# EAGLE design LOCO-Control (EAGLE 9.5.2)
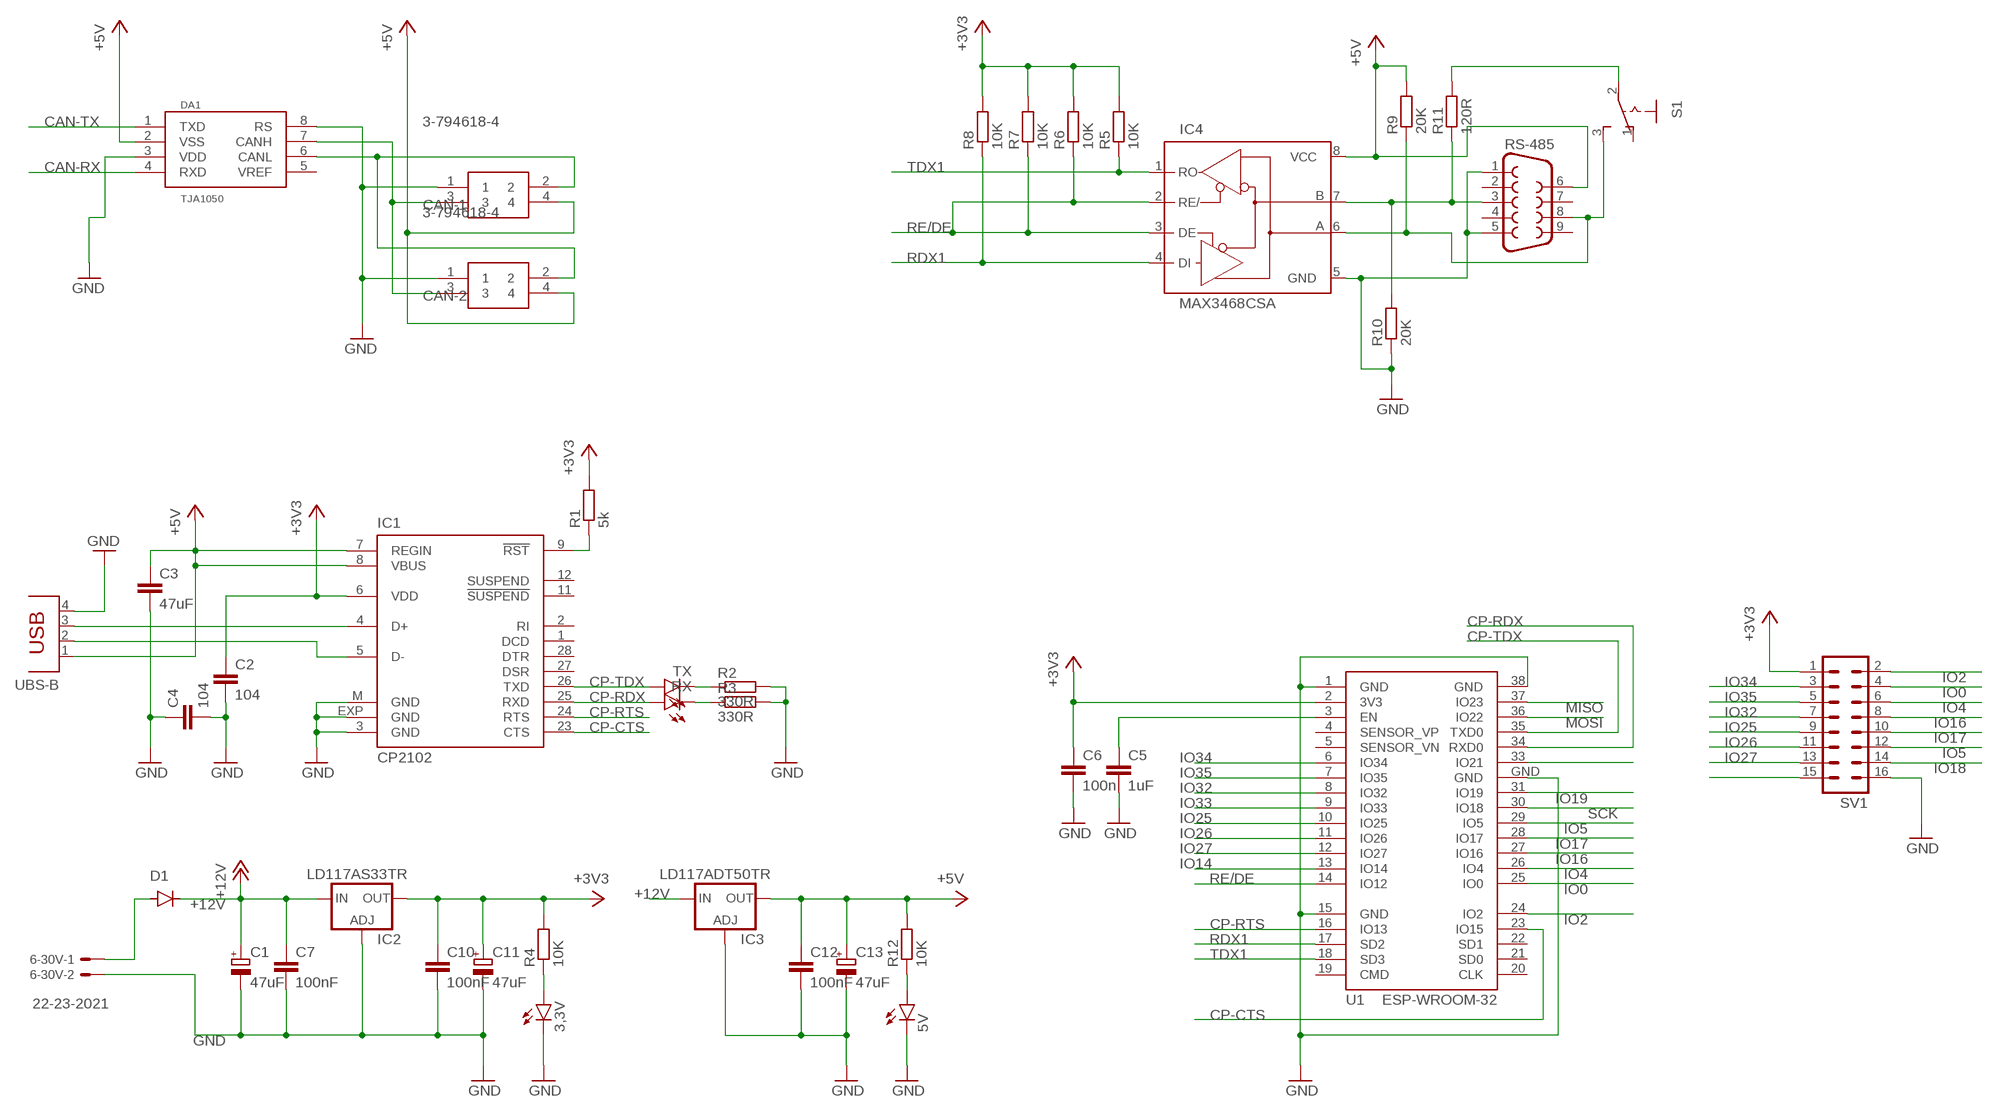
[diagram p0: schematic, sheet 1]

## Parts
3,3V  LED  [SMARTLED-TTW]
5V  LED  [SMARTLED-TTW]
6-30V  22-23-2021  [22-23-2021]
C1  47uF  CPOL-EUB/3528-21R  [B/3528-21R]
C2  104  C-EUC0402  [C0402]
C3  47uF  C-EUC0402  [C0402]
C4  104  C-EUC0402  [C0402]
C5  1uF  C-EUC0402  [C0402]
C6  100n  C-EUC0402  [C0402]
C7  100nF  C-EUC0402  [C0402]
C10  100nF  C-EUC0402  [C0402]
C11  47uF  CPOL-EUB/3528-21R  [B/3528-21R]
C12  100nF  C-EUC0402  [C0402]
C13  47uF  CPOL-EUB/3528-21R  [B/3528-21R]
CAN-1  3-794618-4  [SHDRRA4W102P300_2X2_686X892X73]
CAN-2  3-794618-4  [SHDRRA4W102P300_2X2_686X892X73]
D1  DIODE-DO-214AC  [DO-214AC]
DA1  TJA1050  [SO08]
IC1  CP2102  [MLP28]
IC2  LD117AS33TR  [SOT223]
IC3  LD117ADT50TR  [DPACK]
IC4  MAX3468CSA  [SO08]
R1  5k  R-EU_MELF0102R  [MINI_MELF-0102R]
R2  330R  R-EU_MELF0102R  [MINI_MELF-0102R]
R3  330R  R-EU_MELF0102R  [MINI_MELF-0102R]
R4  10K  R-EU_MELF0102R  [MINI_MELF-0102R]
R5  10K  R-EU_MELF0102R  [MINI_MELF-0102R]
R6  10K  R-EU_MELF0102R  [MINI_MELF-0102R]
R7  10K  R-EU_MELF0102R  [MINI_MELF-0102R]
R8  10K  R-EU_MELF0102R  [MINI_MELF-0102R]
R9  20K  R-EU_MELF0102R  [MINI_MELF-0102R]
R10  20K  R-EU_MELF0102R  [MINI_MELF-0102R]
R11  120R  R-EU_MELF0102R  [MINI_MELF-0102R]
R12  10K  R-EU_MELF0102R  [MINI_MELF-0102R]
RS-485  F09H  [F09H]
RX  LED  [SMARTLED-TTW]
S1  255SB  [255SB]
SV1  MA08-2  [MA08-2]
TX  LED  [SMARTLED-TTW]
U1  ESP-WROOM-32  [ESP-WROOM-32]
UBS-B  PN61729  [PN61729]

## Nets
+3V3: C2.1 C6.1 C10.1 C11.+ IC1.6(VDD) IC2.4(OUT) R1.2 R4.2 R5.2 R6.2 R7.2 R8.2 SV1.1 U1.2(3V3)
+5V: C3.1 C12.1 C13.+ CAN-1.4 CAN-2.4 DA1.2(VSS) IC1.7(REGIN) IC1.8(VBUS) IC3.4(OUT) IC4.8(VCC) R9.2 R12.2 RS-485.6 UBS-B.1
+12V: C1.+ C7.1 D1.C IC2.3(IN) IC3.3(IN)
CAN-RX: DA1.4(RXD)
CAN-TX: DA1.1(TXD)
CP-CTS: IC1.23(CTS) U1.23(IO15)
CP-RDX: IC1.25(RXD) RX.A@1(A) U1.34(RXD0)
CP-RTS: IC1.24(RTS) U1.16(IO13)
CP-TDX: IC1.26(TXD) TX.A@1(A) U1.35(TXD0)
GND: 3,3V.C@1(C) 5V.C@1(C) 6-30V.2 C1.- C2.2 C3.2 C4.1 C4.2 C5.2 C6.2 C7.2 C10.2 C11.- C12.2 C13.- CAN-1.1 CAN-2.1 DA1.3(VDD) DA1.8(RS) IC1.3(GND) IC1.EXP(GND) IC1.M(GND) IC2.1(ADJ) IC3.1(ADJ) IC4.5(GND) R2.2 R3.2 R10.1 RS-485.1 RS-485.5 SV1.16 U1.1(GND) U1.15(GND) U1.38(GND) U1.GND UBS-B.4
IO0: SV1.4 U1.25(IO0)
IO2: SV1.2 U1.24(IO2)
IO4: SV1.6 U1.26(IO4)
IO5: SV1.12 U1.29(IO5)
IO14: SV1.15 U1.13(IO14)
IO16: SV1.8 U1.27(IO16)
IO17: SV1.10 U1.28(IO17)
IO18: SV1.14
IO19: U1.31(IO19)
IO25: SV1.9 U1.10(IO25)
IO26: SV1.11 U1.11(IO26)
IO27: SV1.13 U1.12(IO27)
IO32: SV1.7 U1.8(IO32)
IO33: U1.9(IO33)
IO34: SV1.3 U1.6(IO34)
IO35: SV1.5 U1.7(IO35)
MISO: U1.37(IO23)
MOSI: U1.36(IO22)
N$1: IC1.5(D-) UBS-B.2
N$2: IC1.4(D+) UBS-B.3
N$3: IC1.9(!RST) R1.1
N$4: 6-30V.1 D1.A
N$5: R2.1 TX.C@1(C)
N$6: 3,3V.A@1(A) R4.1
N$7: R3.1 RX.C@1(C)
N$8: CAN-1.3 CAN-2.3 DA1.7(CANH)
N$9: CAN-1.2 CAN-2.2 DA1.6(CANL)
N$10: IC4.6(A) R9.1 RS-485.8 S1.3(S)
N$11: IC4.7(B) R10.2 R11.1 RS-485.3
N$12: R11.2 S1.2(P)
N$13: 5V.A@1(A) R12.1
N$30: U1.33(IO21)
RDX1: IC4.4(DI) R8.1 U1.17(SD2)
RE/DE: IC4.2(RE/) IC4.3(DE) R6.1 R7.1 U1.14(IO12)
RESET: C5.1 U1.3(EN)
SCK: U1.30(IO18)
TDX1: IC4.1(RO) R5.1 U1.18(SD3)
Unconnected: DA1.5(VREF) IC1.1(DCD) IC1.2(RI) IC1.11(!SUSPEND) IC1.12(SUSPEND) IC1.27(DSR) IC1.28(DTR) RS-485.2 RS-485.4 RS-485.7 RS-485.9 S1.1(O) U1.4(SENSOR_VP) U1.5(SENSOR_VN) U1.19(CMD) U1.20(CLK) U1.21(SD0) U1.22(SD1)

## Library data of the parts
3,3V 5V RX TX = led:LED: LED OSRAM: - CHIPLED LG R971, LG N971, LY N971, LG Q971, LY Q971, LO R971, LY R971 LH N974, LH R974 LS Q976, LO Q976, LY Q976 LO Q996 - Hyper CHIPLED LW Q18S LB Q993, LB Q99A, LB R99A - SideLED LS A670, LO A670, LY A670, LG A670, LP A670 LB A673, LV A673, LT A673, LW A673 LH A674 LY A675 LS A676, LA A676, LO A676, LY A676, LW A676 LS A679, LY A679, LG A679 - Hyper Micro SIDELED® LS Y876, LA Y876, LO Y876, LY Y876 LT Y87S - SmartLED LW L88C, LW L88S LB L89C, LB L89S, LG L890 LS L89K, LO L89K, LY L89K LS L896, LA L896, LO L896, LY L896 - TOPLED LS T670, LO T670, LY T670, LG T670, LP T670 LSG T670, LSP T670, LSY T670, LOP T670, LYG T670 LG T671, LOG T671, LSG T671 LB T673, LV T673, LT T673, LW T673 LH T674 LS T676, LA T676, LO T676, LY T676, LB T676, LH T676, LSB T676, LW T676 LB T67C, LV T67C, LT T67C, LS T67K, LO T67K, LY T67K, LW E67C LS E67B, LA E67B, LO E67B, LY E67B, LB E67C, LV E67C, LT E67C LW T67C LS T679, LY T679, LG T679 LS T770, LO T770, LY T770, LG T770, LP T770 LB T773, LV T773, LT T773, LW T773 LH T774 LS E675, LA E675, LY E675, LS T675 LS T776, LA T776, LO T776, LY T776, LB T776 LHGB T686 LT T68C, LB T68C - Hyper Mini TOPLED® LB M676 - Mini TOPLED Santana® LG M470 LS M47K, LO M47K, LY M47K Source: http://www.osram.convergy.de LUXEON: - LUMILED® LXK2-PW12-R00, LXK2-PW12-S00, LXK2-PW14-U00, LXK2-PW14-V00 LXK2-PM12-R00, LXK2-PM12-S00, LXK2-PM14-U00 LXK2-PE12-Q00, LXK2-PE12-R00, LXK2-PE12-S00, LXK2-PE14-T00, LXK2-PE14-U00 LXK2-PB12-K00, LXK2-PB12-L00, LXK2-PB12-M00, LXK2-PB14-N00, LXK2-PB14-P00, LXK2-PB14-Q00 LXK2-PR12-L00, LXK2-PR12-M00, LXK2-PR14-Q00, LXK2-PR14-R00 LXK2-PD12-Q00, LXK2-PD12-R00, LXK2-PD12-S00 LXK2-PH12-R00, LXK2-PH12-S00 LXK2-PL12-P00, LXK2-PL12-Q00, LXK2-PL12-R00 Source: www.luxeon.com KINGBRIGHT: KA-3528ASYC Source: www.kingbright.com
6-30V = con-molex:22-23-2021: .100" (2.54mm) Center Header - 2 Pin; MF: MOLEX; MPN: 22-23-2021; OC_FARNELL: 1462926; OC_NEWARK: 25C3832
C1 C11 C13 = rcl:CPOL-EU: POLARIZED CAPACITOR, European symbol; SPICEPREFIX: C
C2-C7 C10 C12 = rcl:C-EU: CAPACITOR, European symbol; SPICEPREFIX: C
CAN-1 CAN-2 = SamacSys_Parts:3-794618-4: 4 way 2 row r/a header Mate-N-Lok Source: Datasheet <https://rs.componentsearchengine.com/Datasheets/2/3-794618-4.pdf>; DESCRIPTION: 4 way 2 row r/a header Mate-N-Lok; HEIGHT: 7.37mm; MANUFACTURER_NAME: TE Connectivity; MANUFACTURER_PART_NUMBER: 3-794618-4
D1 = diode:DIODE-: DIODE
DA1 = TJA1050:TJA1050: High speed CAN transceiver Input levels compatible with 3.3 V and 5 V devices 5V supply
IC1 = silabs:CP210*: Single-Chip USB to UART Bridge Source: www.silabs.com .. CP2101.pdf / cp2102.pdf; MF: FARNELL; MPN: CP2102-GM; OC_FARNELL: 9282130; OC_NEWARK: 30K5635
IC2 IC3 = v-reg:LD117A?*: Low drop fixed and adjustable positive voltage regulators 1 A Source: http://www.st.com/stonline/products/literature/ds/7194/ld1117axx.pdf
IC4 = maxim:MAX34*: +5V, Fail-Safe, 40Mbps, Profibus RS-485/RS-422 Transceivers Source: MAX3465-MAX3469.pdf; MPN: MAX3468CSA+; OC_FARNELL: unknown; OC_NEWARK: 76K6721
R1-R12 = rcl:R-EU_: RESISTOR, European symbol; SPICEPREFIX: R
RS-485 = con-subd:F09: SUB-D; OC_FARNELL: unknown; OC_NEWARK: unknown
S1 = switch:255SB: SLIDING SWITCH Distributor Buerklin, 11G810
SV1 = con-lstb:MA08-2: PIN HEADER; OC_FARNELL: unknown; OC_NEWARK: unknown
U1 = esp32:ESP-WROOM-32: Espressif Systems ESP-WROOM-32
UBS-B = con-berg:PN61729: BERG USB connector; OC_FARNELL: unknown; OC_NEWARK: unknown

## Board
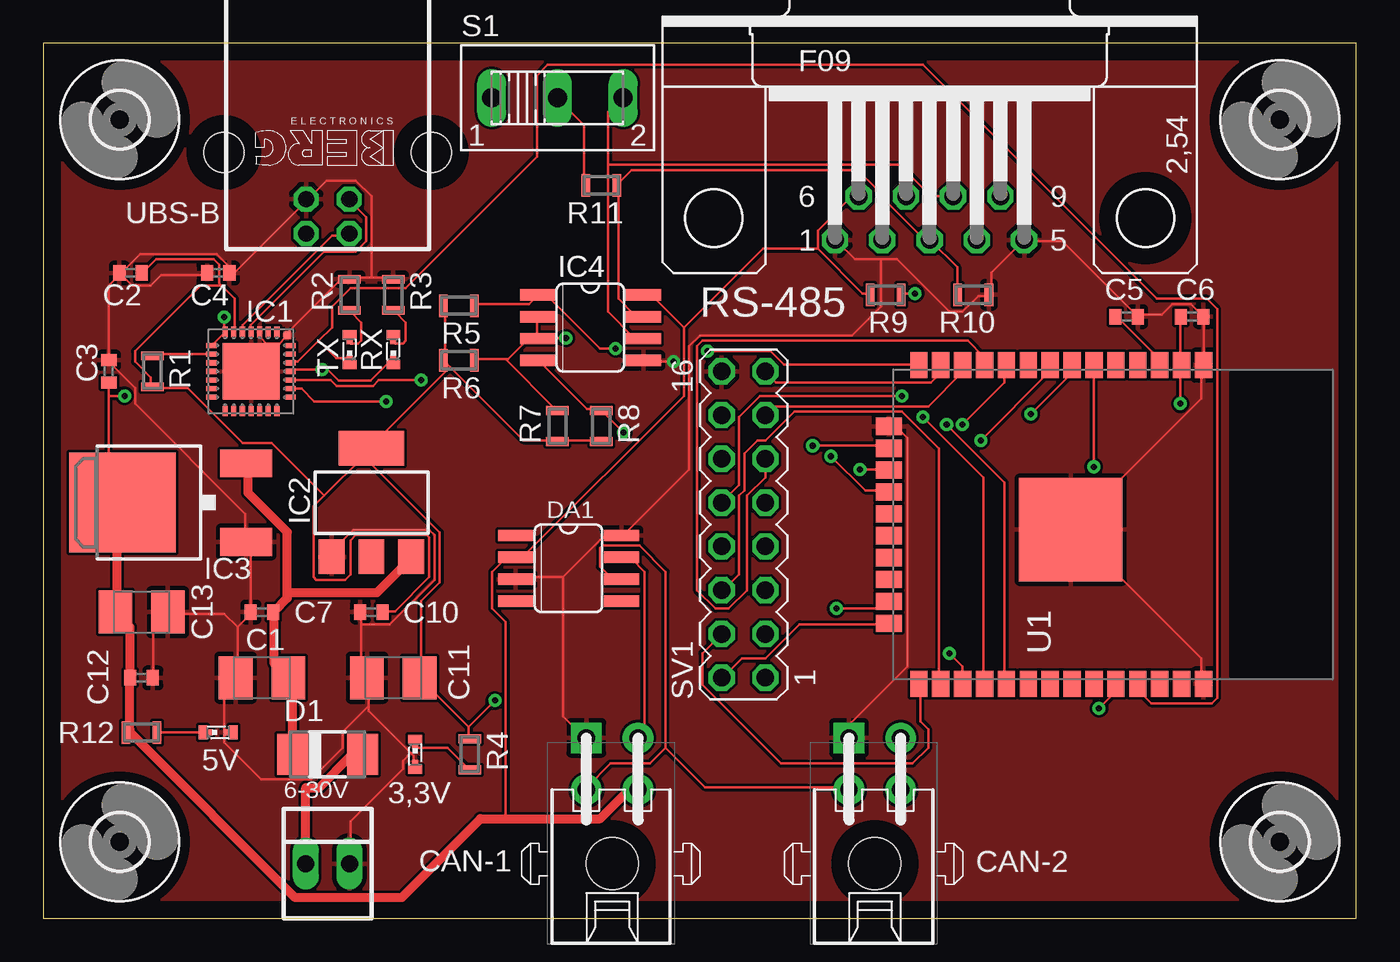
[diagram p1: board, top side]
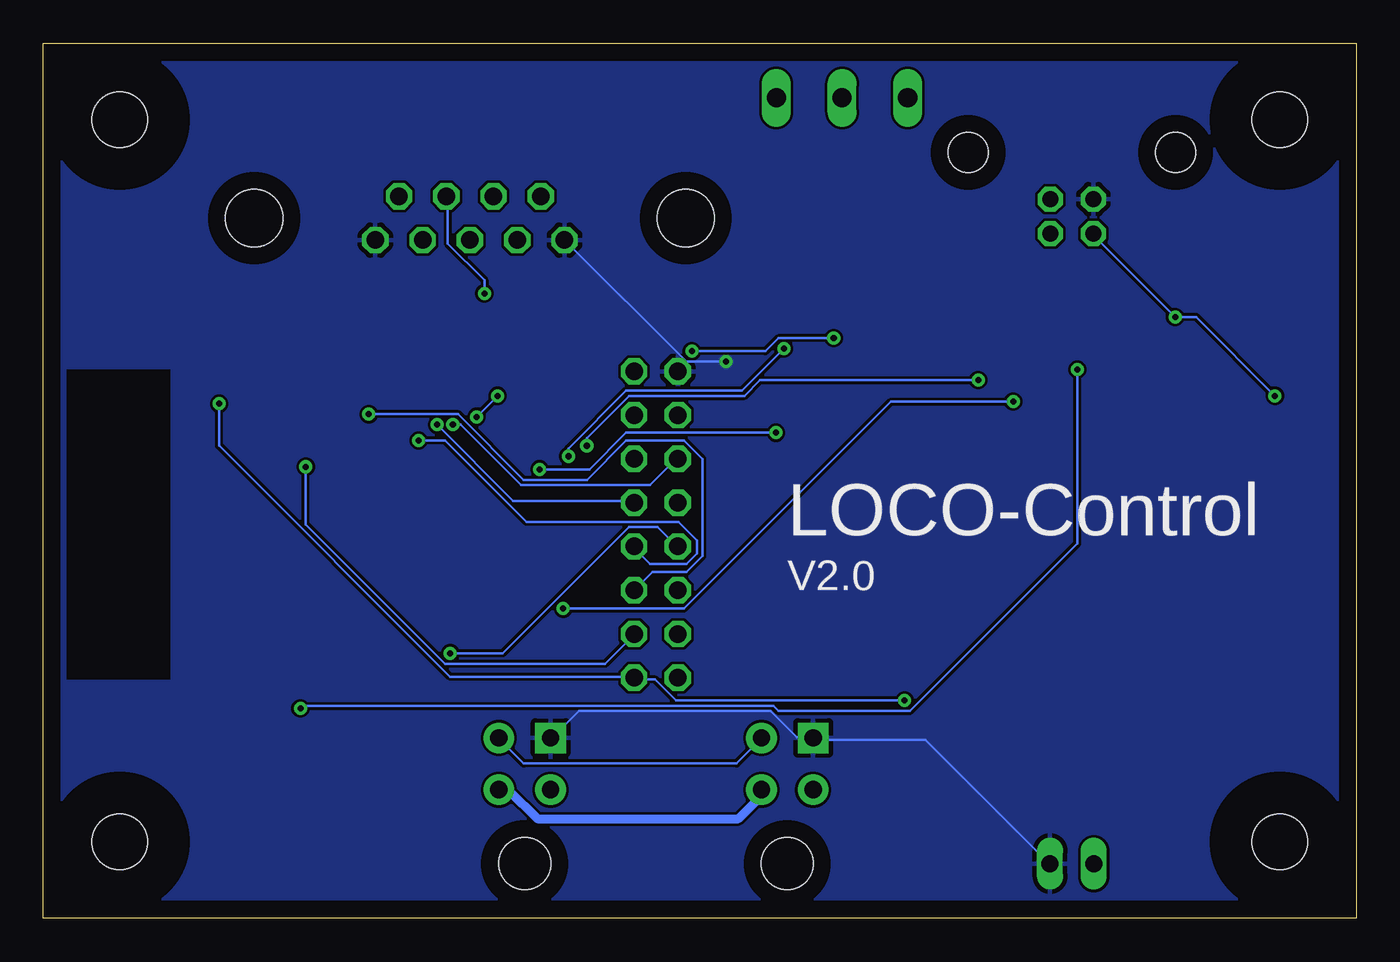
[diagram p2: board, bottom side, seen from below]

Size 76.2 x 50.8 mm. Coordinates in mm from the lower left corner, seen from the top.
Outline: 0,0 76.2,0 76.2,50.8 0,50.8 0,0
Copper layers (1*16): Top 0.035mm / dielectric 1.5mm / Bottom 0.035mm
Design rules "default": minimum track width 6mil, minimum drill 0.35mm, track to track 6mil, track to pad 6mil, pad to pad 6mil, via to via 6mil, smd to smd 6mil, copper to edge 40mil, drill to drill 6mil, minimum pad ring 10mil, minimum via ring 8mil, stop-mask expansion 4mil, vias tented up to drill 0mil, thermal gap 10mil

### Footprints (pad centres in the part's own frame; a part is rotated, then mirrored left to right if it is on the bottom)
SMARTLED-TTW = smd 0.8 x 0.5: A 0,-0.875; C 0,0.875 | smd 0.35 x 0.35: A@1 0,-0.5; C@1 0,0.5
22-23-2021 = drill 1 long: 1 -1.27,0; 2 1.27,0
B/3528-21R = smd 1.95 x 2.5: + 1.525,0; - -1.525,0
C0402 = smd 0.7 x 0.9: 1 -0.65,0; 2 0.65,0
SHDRRA4W102P300_2X2_686X892X73 = drill 1 pad 1.778 square: 1 1.5,-7.3 | drill 1 pad 1.778: 2 1.5,-4.3; 3 -1.5,-7.3; 4 -1.5,-4.3 | hole 3: 0,0
DO-214AC = smd 1.8 x 2.4: A 2.025,0; C -2.025,0
SO08 = smd 0.66 x 2.032: 1 -1.905,-3.073; 2 -0.635,-3.073; 3 0.635,-3.073; 4 1.905,-3.073; 5 1.905,3.073; 6 0.635,3.073; 7 -0.635,3.073; 8 -1.905,3.073
MLP28 = smd 0.6 x 0.3: 1 -2.3,1.5; 2 -2.3,1; 3 -2.3,0.5; 4 -2.3,0; 5 -2.3,-0.5; 6 -2.3,-1; 7 -2.3,-1.5; 15 2.3,-1.5; 16 2.3,-1; 17 2.3,-0.5; 18 2.3,0; 19 2.3,0.5; 20 2.3,1; 21 2.3,1.5 | smd 0.3 x 0.6: 8 -1.5,-2.3; 9 -1,-2.3; 10 -0.5,-2.3; 11 0,-2.3; 12 0.5,-2.3; 13 1,-2.3; 14 1.5,-2.3; 22 1.5,2.3; 23 1,2.3; 24 0.5,2.3; 25 0,2.3; 26 -0.5,2.3; 27 -1,2.3; 28 -1.5,2.3 | smd 3.3 x 3.3: EXP 0,0 | smd 0.435 x 0.435: M -2.103,2.103
SOT223 = smd 1.5 x 2: 1 -2.3,-3.15; 2 0,-3.15; 3 2.3,-3.15 | smd 3.8 x 2: 4 0,3.15
DPACK = smd 1.6 x 3: 1 -2.28,-4.8; 3 2.28,-4.8 | smd 5.8 x 6.2: 4 0,2.38
MINI_MELF-0102R = smd 0.5 x 1.3: 1 -0.9,0; 2 0.9,0
F09H = drill 1.016 octagon: 1 -5.486,-1.27; 2 -2.743,-1.27; 3 0,-1.27; 4 2.743,-1.27; 5 5.486,-1.27; 6 -4.115,1.27; 7 -1.372,1.27; 8 1.372,1.27; 9 4.115,1.27 | hole 3.302: -12.522,0; 12.522,0
255SB = drill 1.118 long: 1 -3.81,0; 2 0,0; 3 3.81,0
MA08-2 = drill 1.016 octagon: 1 -8.89,-1.27; 2 -8.89,1.27; 3 -6.35,-1.27; 4 -6.35,1.27; 5 -3.81,-1.27; 6 -3.81,1.27; 7 -1.27,-1.27; 8 -1.27,1.27; 9 1.27,-1.27; 10 1.27,1.27; 11 3.81,-1.27; 12 3.81,1.27; 13 6.35,-1.27; 14 6.35,1.27; 15 8.89,-1.27; 16 8.89,1.27
ESP-WROOM-32 = smd 1.5 x 1: 1 -9.25,7; 2 -9.25,5.73; 3 -9.25,4.46; 4 -9.25,3.19; 5 -9.25,1.92; 6 -9.25,0.65; 7 -9.25,-0.62; 8 -9.25,-1.89; 9 -9.25,-3.16; 10 -9.25,-4.43; 11 -9.25,-5.7; 12 -9.25,-6.97; 13 -9.25,-8.24; 14 -9.25,-9.51; 25 9.25,-9.51; 26 9.25,-8.24; 27 9.25,-6.97; 28 9.25,-5.7; 29 9.25,-4.43; 30 9.25,-3.16; 31 9.25,-1.89; 32 9.25,-0.62; 33 9.25,0.65; 34 9.25,1.92; 35 9.25,3.19; 36 9.25,4.46; 37 9.25,5.73; 38 9.25,7 | smd 1 x 1.5: 15 -5.7,-11.25; 16 -4.43,-11.25; 17 -3.16,-11.25; 18 -1.89,-11.25; 19 -0.62,-11.25; 20 0.65,-11.25; 21 1.92,-11.25; 22 3.19,-11.25; 23 4.46,-11.25; 24 5.73,-11.25 | smd 6 x 6: GND 0.3,-0.7
3,2 = hole 3.2: 0,0
PN61729 = drill 0.95 octagon: 1 1.25,4.71; 2 -1.25,4.71; 3 -1.25,2.71; 4 1.25,2.71 | hole 2.3: -6.02,0; 6.02,0

### Placement (x,y rotation side)
3,3V  21.59,9.53 180 top
5V  10.16,10.79 270 top
6-30V  16.51,3.17 0 top
C1  12.7,13.97 0 top
C2  5.08,37.47 180 top
C3  3.81,31.75 90 top
C4  10.16,37.47 180 top
C5  62.87,34.92 0 top
C6  66.67,34.92 0 top
C7  12.7,17.78 180 top
C10  19.05,17.78 180 top
C11  20.32,13.97 0 top
C12  5.71,13.97 0 top
C13  5.71,17.78 180 top
CAN-1  33.02,3.17 180 top
CAN-2  48.26,3.17 180 top
D1  16.51,9.53 0 top
DA1  30.48,20.32 270 top
IC1  12.06,31.75 270 top
IC2  19.05,24.13 0 top
IC3  6.99,24.13 90 top
IC4  31.75,34.29 270 top
R1  6.35,31.75 270 top
R2  17.78,36.2 90 top
R3  20.32,36.2 90 top
R4  24.77,9.53 90 top
R5  24.13,35.56 180 top
R6  24.13,32.38 180 top
R7  29.84,28.57 270 top
R8  32.38,28.57 270 top
R9  48.9,36.2 180 top
R10  53.98,36.2 180 top
R11  32.38,42.55 180 top
R12  5.71,10.79 180 top
RS-485  51.44,40.64 0 top
RX  20.32,33.02 0 top
S1  29.84,47.62 0 top
SV1  40.64,22.86 90 top
TX  17.78,33.02 0 top
U1  60.33,22.86 270 top
U$2  [3,2]  4.45,4.45 0 top
U$3  [3,2]  71.75,4.45 0 top
U$4  [3,2]  4.45,46.35 0 top
U$5  [3,2]  71.75,46.35 0 top
UBS-B  16.51,44.45 180 top

### Tracks (layer width: path | path; a pad name or v marks a point on that pad's centre or on a via)
+3V3  (via drill 0.35)
  Top 0.152: C6.1 65.99,34.9 65.99,32.16 U1.2 65.99,32 v65.99,29.87 | R8.2 32.31,27.74 29.87,27.74 R7.2 29.72,27.74 27.89,27.74 23.62,32 | R5.2 23.32,35.51 23.32,32.46 R6.2 23.32,32.31 23.62,32 | 10.36,36.73 10.21,36.88 10.21,37.95 9.91,38.25 6.55,38.25 5.79,37.49 C2.1 | 10.36,36.73 11.12,35.97 11.12,34.14 IC1.6 | 10.36,36.73 9.14,36.73 5.33,32.92 5.33,32.31 6.25,31.39 6.25,30.94 R1.2 6.4,30.79 8.38,30.79 11.58,27.58 13.26,27.58 16.31,24.54 | 24.69,11.12 24.69,10.52 R4.2 | 24.69,11.12 21.95,13.87 C11.+ 21.95,14.02 21.95,18.44 23.01,19.51 23.01,22.4 18.59,26.82 | IC2.4 18.59,26.82 | 18.59,26.82 16.31,24.54 | 16.31,24.54 15.7,23.93 15.7,19.81 15.85,19.66 17.53,19.66 17.83,19.96 17.83,21.95 18.14,22.25 22.25,22.25 22.4,22.1 22.4,19.81 20.42,17.83 19.81,17.83 C10.1 | IC2.4 | 18.59,26.82 IC2.4 | 23.62,32 19.05,27.43 IC2.4 | 24.69,11.12 v26.21,12.65
  Bottom 0.152: v65.99,29.87 65.99,27.43 52.58,14.02 41.91,14.02 SV1.1 41.91,13.87 40.69,13.87 39.47,12.65 v26.21,12.65
+5V  (via drill 0.35)
  Top 0.152: IC1.8 9.91,33.38 10.52,33.98 IC1.7 10.52,34.14 v10.52,34.9 | 5.03,13.87 C12.1 5.03,14.02 | 4.88,10.82 R12.2 4.97,10.79 5.01,10.83 5.03,10.84 | 4.27,17.68 C13.+ 4.27,17.83 | 3.81,30.33 3.81,24.99 4.57,24.23 IC3.4 4.57,24.08 4.27,23.77 | 3.81,30.33 C3.1 | 3.81,30.33 v4.72,30.33 | 44.96,38.86 47.55,36.27 47.85,36.27 R9.2 | 44.96,38.86 44.96,39.93 46.94,41.91 RS-485.6 | 37.19,34.29 37.19,30.33 27.89,21.03 27.43,21.03 DA1.2 27.28,20.88 26.82,20.88 26.06,20.12 26.06,17.98 26.82,17.22 26.82,5.79 | 37.19,34.29 35.36,36.12 34.9,36.12 IC4.8 | 44.96,38.86 41.76,38.86 37.19,34.29
  Top 0.508: 5.03,10.84 5.03,10.97 | 5.03,10.97 5.03,13.87 | 4.88,10.82 5.03,10.97 | 5.03,14.02 5.03,16.92 4.27,17.68 | 4.27,23.77 4.27,17.83 | CAN-1.4 34.01,7.47 32.31,5.79 26.82,5.79 25.38,5.79 20.81,1.21 14.63,1.21 5.01,10.83
  Bottom 0.152: UBS-B.1 15.24,39.62 v10.52,34.9 9.3,34.9 v4.72,30.33
  Bottom 0.508: CAN-1.4 34.52,7.12 35.86,5.79 47.52,5.79 49.16,7.42 CAN-2.4
+12V
  Top 0.152: 13.41,17.68 C7.1 13.41,17.83 | 14.18,14.02 14.17,14.02 | 11.89,26.36 IC3.3
  Top 0.508: 13.41,17.68 13.41,14.78 14.17,14.02 | IC2.3 21.35,20.88 19.38,18.91 14.17,18.91 | 13.41,17.83 14.17,18.59 14.17,18.91 | 11.89,26.36 11.89,24.7 14.17,22.42 14.17,18.91 | D1.C 14.48,13.97 C1.+ 14.33,13.97 14.33,13.87 14.18,13.87 14.18,14.02
CP-CTS  (via drill 0.35)
  Top 0.152: v19.91,30 15.72,30 15,30.75 IC1.23 | v46.02,17.98 48.77,17.98 49.07,18.29 U1.23
  Bottom 0.152: v19.91,30 27,30 39.01,17.98 v46.02,17.98
CP-RDX  (via drill 0.35)
  Top 0.152: v61.27,12.19 62.18,13.11 62.18,13.56 U1.34 | IC1.25 14.48,31.85 v16.19,31.85 16.51,31.85 17.14,31.22 19.02,31.22 RX.A@1
  Bottom 0.152: v16.19,31.85 16.19,21.75 25.91,12.04 33.53,12.04 33.83,12.34 61.11,12.34 v61.27,12.19
CP-RTS  (via drill 0.35)
  Top 0.152: v44.65,27.43 49.07,27.43 U1.16 | IC1.24 14.37,31.24 16.69,31.24 17.02,30.91 19.14,30.91 19.47,31.24 v21.95,31.24
  Bottom 0.152: v21.95,31.24 34.59,31.24 35.51,30.33 42.22,30.33 44.65,27.89 v44.65,27.43
CP-TDX
  Top 0.152: 16,33.53 16.76,34.29 16.76,35.51 17.83,36.58 21.03,36.58 28.65,44.2 28.65,48.92 29.26,49.53 51.05,49.53 64.62,35.97 67.51,35.97 68.12,35.36 68.12,12.8 67.82,12.5 64.31,12.5 63.55,13.26 63.55,13.56 U1.35 | 16,33.53 14.78,32.31 14.48,32.31 IC1.26 | TX.A@1 17.01,32.52 16,33.53
GND  (via drill 0.35)
  Top 0.152: U1.38 67.21,13.72 67.21,15.09 59.74,22.55 U1.GND 59.74,22.71 67.21,30.18 67.21,32 U1.1 67.36,32.16 67.36,34.9 C6.2 67.21,35.05 66.6,35.66 65.53,35.66 64.92,35.05 63.55,35.05 C5.2 63.4,35.05 59.13,39.32 57,39.32 RS-485.5 56.84,39.32 55.02,37.49 55.02,36.27 R10.1 54.86,36.12 54.25,36.12 53.34,35.2 52.58,35.2 49.53,38.25 48.62,38.25 | v36.58,32.31 34.9,32.31 IC4.5 | 48.62,38.25 47.09,38.25 46.02,39.32 RS-485.1 | 30.18,19.81 27.43,19.81 DA1.3 | 30.18,19.81 32.46,22.1 33.53,22.1 DA1.8 33.68,22.25 37.49,26.06 37.49,33.22 38.1,33.83 46.94,33.83 48.62,35.51 48.62,38.25 | 30.18,19.81 30.18,11.73 31.39,10.52 CAN-1.1 | U1.15 49.23,28.5 49.53,28.5 50.14,27.89 50.14,14.63 46.79,11.28 46.79,10.52 CAN-2.1 | 19.05,37.19 20.27,37.19 R3.2 | 19.05,37.19 17.83,37.19 R2.2 17.68,37.03 17.22,37.03 14.17,33.98 IC1.M 14.02,33.83 14.02,33.68 13.72,33.38 12.95,33.38 | 12.95,33.38 12.65,33.68 12.65,33.98 IC1.3 | 12.95,33.38 12.95,32.61 12.19,31.85 IC1.EXP | C2.2 4.42,37.34 3.81,36.73 C3.2 3.81,32.31 5.33,30.79 5.33,29.87 11.73,23.47 11.73,21.95 IC3.1 11.89,21.79 12.04,21.64 12.04,17.83 C7.2 12.04,17.68 11.28,16.92 | C4.2 9.45,37.34 6.86,37.34 6.25,36.73 5.18,36.73 4.57,37.34 C2.2 | C2.2 4.57,37.49 5.64,38.56 10.06,38.56 10.67,37.95 10.67,37.49 C4.1 10.82,37.49 11.12,37.49 15.24,41.6 UBS-B.4 15.39,41.76 16.46,42.82 18.14,42.82 19.05,41.91 19.05,37.19 | C12.2 6.4,14.02 6.4,16.92 7.16,17.68 C13.- 7.32,17.68 10.52,17.68 11.28,16.92 | 11.28,16.92 11.28,14.02 C1.- 11.12,13.87 10.52,13.26 10.52,10.82 5V.C@1 10.52,10.67 10.52,10.21 12.65,8.08 15.54,8.08 17.37,9.91 17.37,10.82 18.9,12.34
  Top 0.152: 21.34,9.6 18.9,12.04 18.9,12.34 | 21.34,9.6 21.49,9.45 21.49,9.14 3,3V.C@1 | 18.9,12.34 18.9,13.87 C11.- 18.75,14.02 18.44,14.33 18.44,17.07 | 18.44,17.07 18.44,17.68 C10.2 | 18.44,17.07 20.12,17.07 22.71,19.66 22.71,22.25 22.4,22.55 17.98,22.55 16.76,21.34 16.76,21.03 IC2.1 | 21.34,9.6 20.88,9.14 20.88,8.69 17.83,5.64 17.83,3.2 6-30V.2
  Bottom 0.152: 38.86,32.31 v36.58,32.31 | 38.86,32.31 39.32,31.85 SV1.16 38.86,32.31 | 38.86,32.31 45.87,39.32 RS-485.1 | CAN-2.1 46.63,10.52 45.11,12.04 33.98,12.04 32.46,10.52 31.55,10.52 CAN-1.1 31.39,10.36 24.99,10.36 17.83,3.2 6-30V.2
  pour Top: 0,50.8 76.2,50.8 76.2,0 0,0
  pour Bottom: 0,50.8 76.2,50.8 76.2,0 0,0
IO0
  Top 0.152: SV1.4 38.25,15.39 38.25,13.56 42.82,8.99 50.44,8.99 51.36,9.91 51.36,10.97 50.9,11.43 50.9,13.56 U1.25
IO2
  Top 0.152: U1.24 49.07,17.07 43.89,17.07 41.91,15.09 40.54,15.09 39.47,14.02 SV1.2
IO4
  Top 0.152: U1.26 51.97,13.72 51.97,27.28 49.84,29.41 43.59,29.41 41.91,27.74 41.45,27.74 40.69,26.98 40.69,24.84 40.39,24.54 40.39,19.96 39.47,19.05 SV1.6
IO5  (via drill 0.35)
  Top 0.152: v52.43,28.65 55.78,25.3 55.78,13.72 U1.29
  Bottom 0.152: v52.43,28.65 51.97,28.65 48.46,25.15 41,25.15 39.47,26.67 SV1.12
IO14
  Top 0.152: U1.13 51.97,32 51.97,31.55 51.51,31.09 42.52,31.09 41.91,31.7 SV1.15
IO16  (via drill 0.35)
  Top 0.152: v52.58,15.39 53.34,14.63 53.34,13.72 U1.27
  Bottom 0.152: v52.58,15.39 49.53,15.39 42.22,22.71 40.54,22.71 39.47,21.64 SV1.8
IO17  (via drill 0.35)
  Top 0.152: v51.05,29.11 54.56,25.6 54.56,13.72 U1.28 | v49.84,30.33 41.6,30.33 40.39,29.11 40.39,25.15 SV1.10
  Bottom 0.152: v49.84,30.33 v51.05,29.11
IO25  (via drill 0.35)
  Top 0.152: v53.34,28.65 55.78,31.09 55.78,32 U1.10
  Bottom 0.152: v53.34,28.65 48.92,24.23 41.91,24.23 SV1.9
IO26
  Top 0.152: SV1.11 41.91,25.6 40.84,24.54 40.84,19.05 39.78,17.98 39.01,17.98 37.95,19.05 37.95,33.22 38.25,33.53 53.65,33.53 54.56,32.61 54.56,32.16 U1.11
IO27
  Top 0.152: U1.12 53.34,32 53.34,31.7 51.36,29.72 42.37,29.72 41.91,29.26 SV1.13
IO32  (via drill 0.35)
  Top 0.152: v54.41,27.74 58.37,31.7 58.37,32 U1.8
  Bottom 0.152: v54.41,27.74 52.88,27.74 48.16,23.01 39.32,23.01 38.25,21.95 38.25,21.18 38.86,20.57 41,20.57 41.91,21.49 SV1.7
IO34  (via drill 0.35)
  Top 0.152: v60.96,26.21 60.96,32 U1.6
  Bottom 0.152: v60.96,26.21 60.96,22.86 52.88,14.78 43.59,14.78 41.91,16.46 SV1.3
IO35  (via drill 0.35)
  Top 0.152: v57.3,29.26 59.59,31.55 59.59,32 U1.7
  Bottom 0.152: v57.3,29.26 52.12,29.26 48.31,25.45 44.65,25.45 42.37,27.74 39.01,27.74 37.95,26.67 37.95,21.03 38.86,20.12 40.84,20.12 SV1.5
N$1
  Top 0.152: IC1.5 11.58,34.14 11.58,34.44 16.76,39.62 17.68,39.62 UBS-B.2
N$2
  Top 0.152: IC1.4 12.04,34.14 12.04,34.44 16.31,38.71 18.14,38.71 18.75,39.32 18.75,40.69 17.83,41.6 UBS-B.3
N$3
  Top 0.152: IC1.9 9.75,32.77 6.4,32.77 R1.1
N$4
  Top 0.152: 18.44,9.45 D1.A
  Top 0.508: 6-30V.1 15.24,7.59 16.03,7.59 17.86,9.42 17.86,9.45 18.44,9.45
N$5
  Top 0.152: TX.C@1 17.83,33.38 18.29,33.38 18.44,33.53 18.44,34.59 17.83,35.2 R2.1
N$6
  Top 0.152: 3,3V.A@1 21.64,9.91 23.47,9.91 24.69,8.69 R4.1
N$7
  Top 0.152: RX.C@1 20.42,33.38 20.88,33.38 21.03,33.53 21.03,34.59 20.42,35.2 R3.1
N$8
  Top 0.152: DA1.7 33.68,20.88 34.14,20.88 34.9,20.12 34.9,10.82 34.59,10.52 CAN-1.3
  Bottom 0.152: CAN-2.3 49.68,10.36 48.31,8.99 35.97,8.99 34.59,10.36 CAN-1.3
N$9
  Top 0.152: 36.12,9.91 36.12,20.12 34.59,21.64 32.46,21.64 32.31,21.49 32.31,20.42 32.92,19.81 33.53,19.81 DA1.6 | 36.12,9.91 35.2,8.99 32.92,8.99 31.55,7.62 CAN-1.2 | 36.12,9.91 38.41,7.62 46.63,7.62 CAN-2.2
N$10  (via drill 0.35)
  Top 0.152: v50.6,36.27 49.84,36.27 R9.1 | 32.77,43.74 32.77,46.79 33.53,47.55 S1.3 | 32.77,43.74 32.77,35.2 34.29,33.68 34.75,33.68 IC4.6 | RS-485.8 51.51,41.91 49.68,43.74 32.77,43.74
  Bottom 0.152: v50.6,36.27 50.6,37.03 52.73,39.17 52.73,41.91 RS-485.8
N$11
  Top 0.152: R10.2 53.03,36.27 53.03,37.8 51.51,39.32 RS-485.3 51.36,39.47 51.05,39.47 48.31,42.22 48.31,42.37 47.24,43.43 34.14,43.43 33.38,42.67 R11.1 33.38,42.52 33.38,35.97 34.29,35.05 34.75,35.05 IC4.7
N$12
  Top 0.152: R11.2 31.39,42.67 31.39,46.02 29.87,47.55 S1.2
N$13
  Top 0.152: 5V.A@1 R12.1
RDX1  (via drill 0.35)
  Top 0.152: IC4.4 28.8,32.31 31.55,29.57 32.31,29.57 R8.1 32.46,29.41 v33.68,28.19 | v47.4,26.06 49.07,26.06 U1.17
  Bottom 0.152: v47.4,26.06 44.5,26.06 42.37,28.19 v33.68,28.19
RE/DE  (via drill 0.35)
  Top 0.152: 26.82,32.46 26.98,32.46 28.04,33.53 28.65,33.53 IC4.3 | 26.82,32.46 25.15,32.46 R6.1 | 26.82,32.46 29.72,29.57 R7.1 | v38.56,32.92 42.22,32.92 42.98,32.16 50.75,32.16 U1.14 | v30.33,33.68 28.8,33.68 IC4.3 | IC4.2 28.65,34.9 28.65,33.68 IC4.3
  Bottom 0.152: v38.56,32.92 34.29,32.92 33.53,33.68 v30.33,33.68
RESET
  Top 0.152: C5.1 62.33,34.9 64.77,32.46 64.77,32.16 U1.3
TDX1  (via drill 0.35)
  Top 0.152: R5.1 25.15,35.66 28.19,35.66 28.65,36.12 IC4.1 28.8,36.12 29.26,36.12 32.31,33.07 v33.22,33.07 | v45.72,26.82 47.7,24.84 49.07,24.84 U1.18
  Bottom 0.152: v45.72,26.82 45.72,27.28 42.37,30.63 35.66,30.63 v33.22,33.07

### Text on the board
bNames: LOCO-Control | V2.0